# Altium project BF-5-0-0.PrjPCB
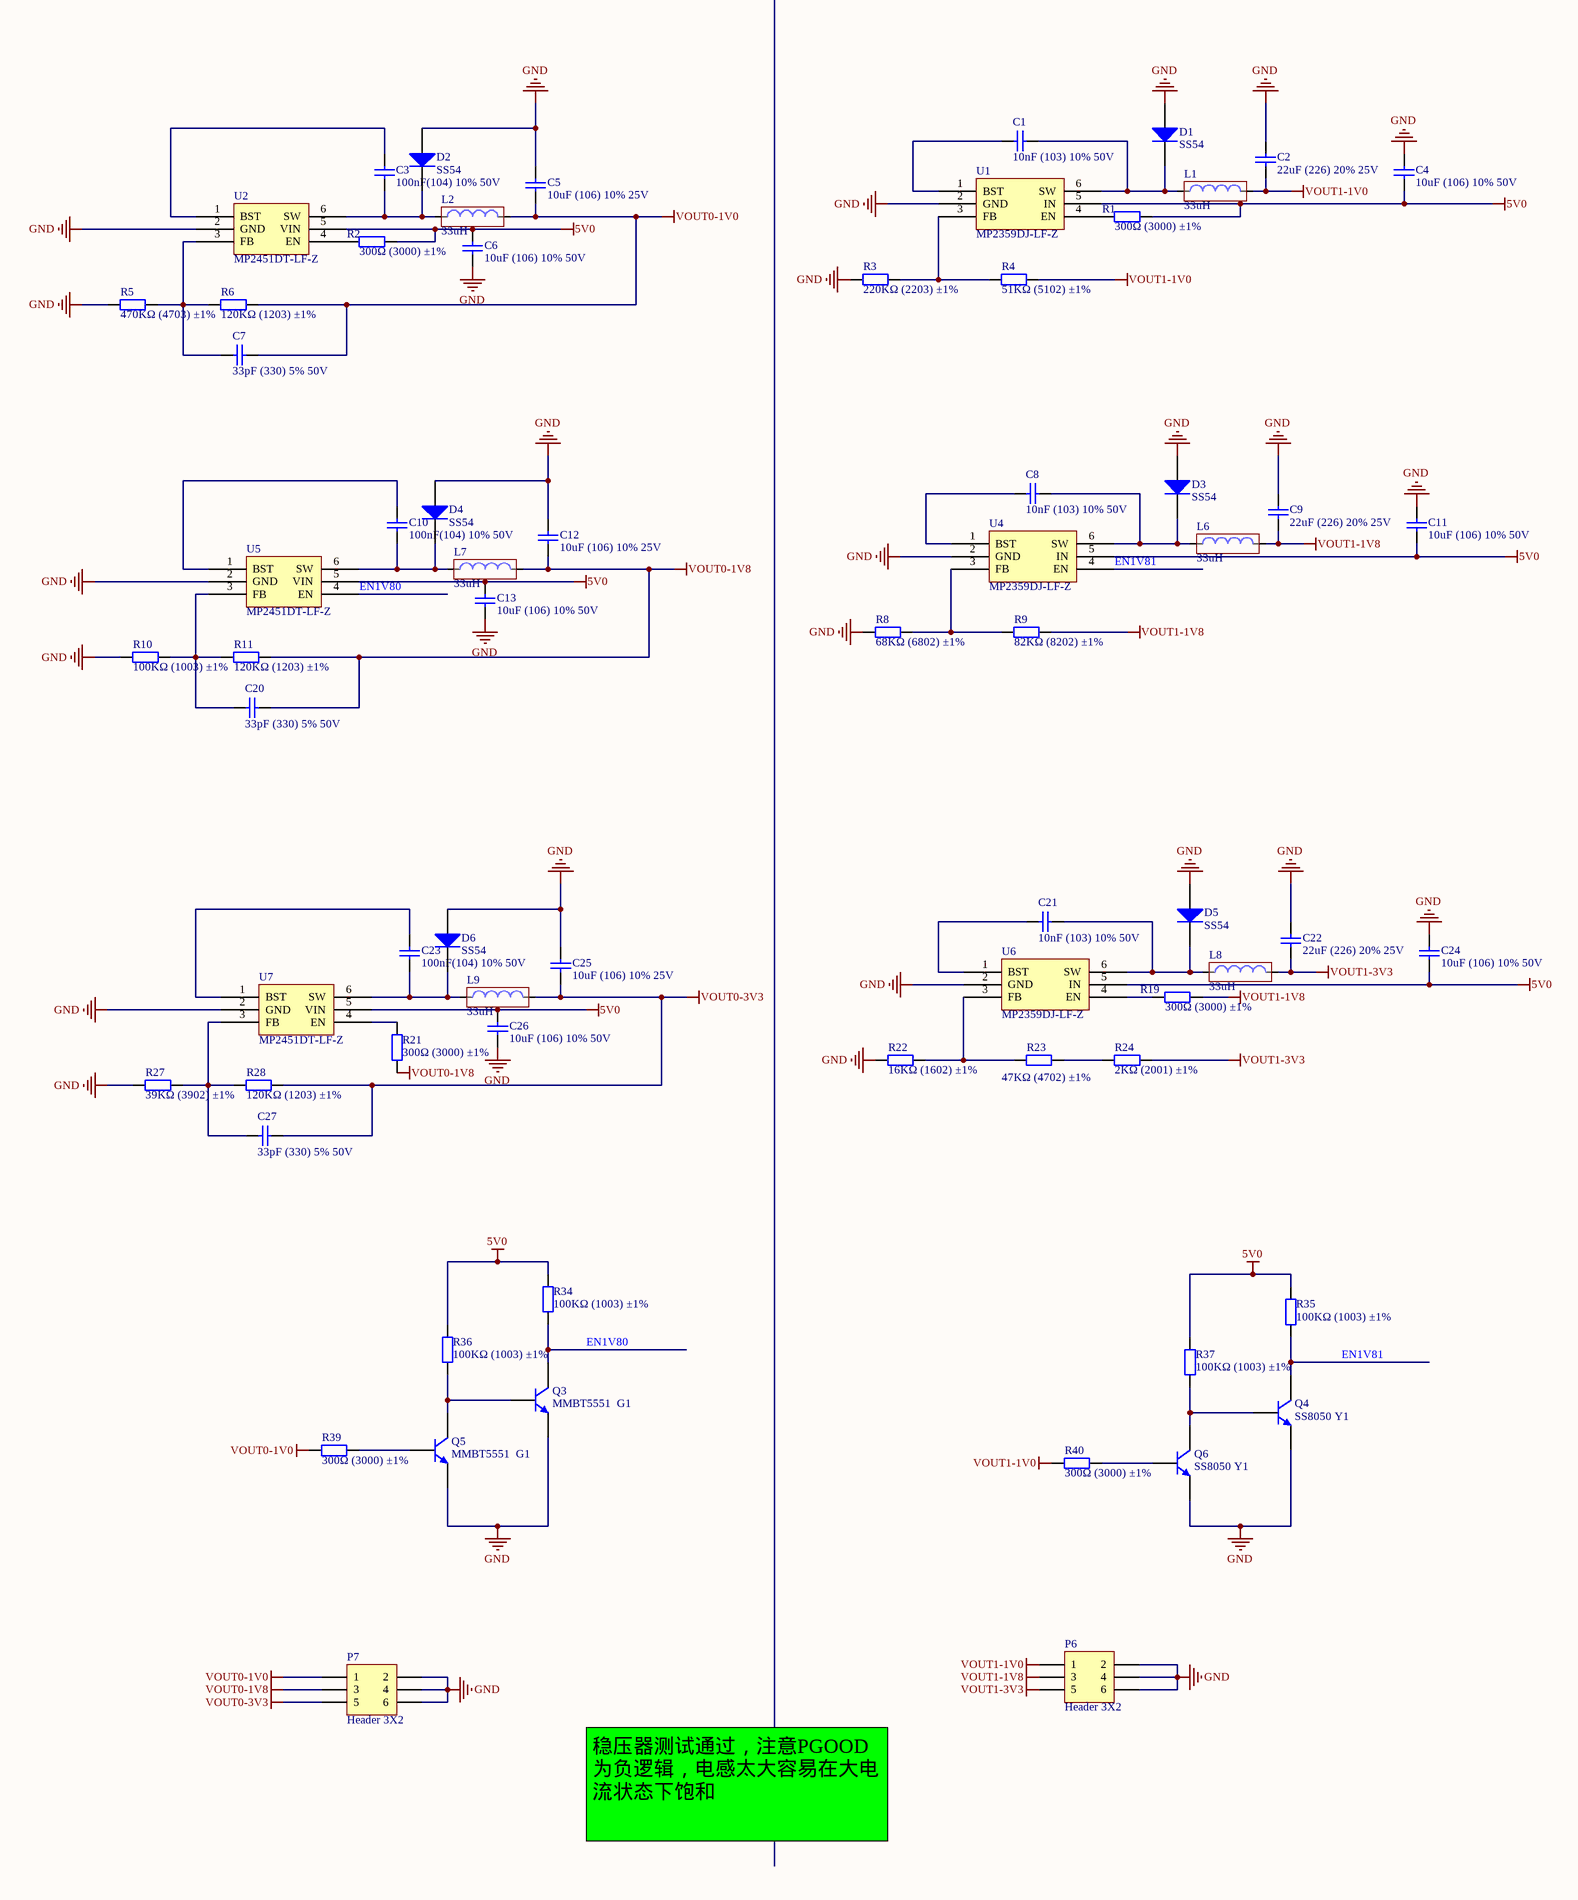
[diagram p0: BF-5-0-0.SchDoc, left]
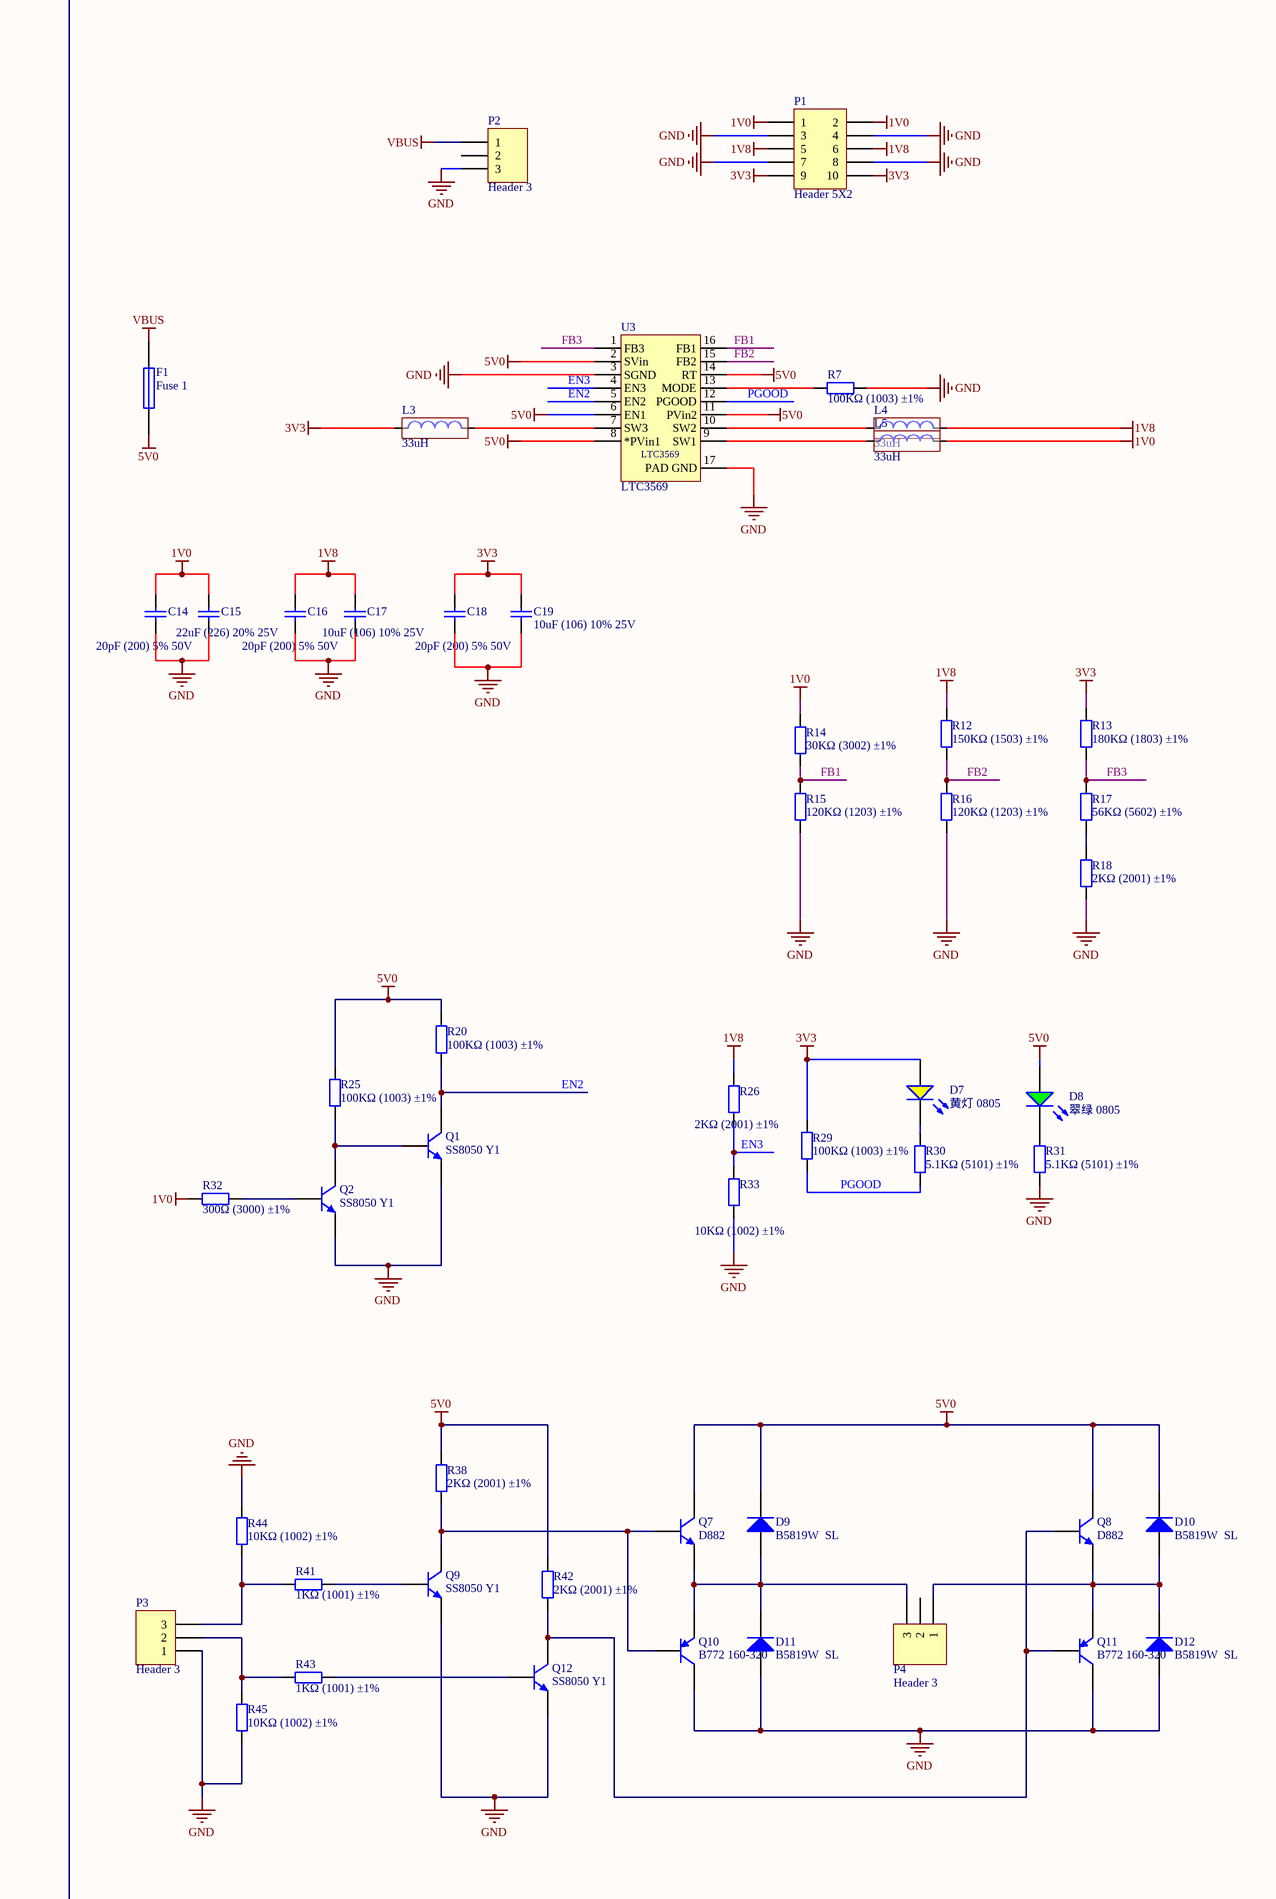
[diagram p1: BF-5-0-0.SchDoc, right]
1 sheet, 119 parts. Net scope: global (net labels, ports and power ports of the same name join across sheets).
Board file: BF-5-0-0.PcbDoc

## Sheet BF-5-0-0.SchDoc
size A2

### Parts
C1  10nF (103) 10% 50V  [0805_C]
C2  22uF (226) 20% 25V  [0805_C]
C3  100nF(104) 10% 50V  [0805_C]
C4  10uF (106) 10% 50V  [1206_C]
C5  10uF (106) 10% 25V  [0805_C]
C6  10uF (106) 10% 50V  [1206_C]
C7  33pF (330) 5% 50V  [0805_C]
C8  10nF (103) 10% 50V  [0805_C]
C9  22uF (226) 20% 25V  [0805_C]
C10  100nF(104) 10% 50V  [0805_C]
C11  10uF (106) 10% 50V  [1206_C]
C12  10uF (106) 10% 25V  [0805_C]
C13  10uF (106) 10% 50V  [1206_C]
C14  20pF (200) 5% 50V  [0805_C]
C15  22uF (226) 20% 25V  [0805_C]
C16  20pF (200) 5% 50V  [0805_C]
C17  10uF (106) 10% 25V  [0805_C]
C18  20pF (200) 5% 50V  [0805_C]
C19  10uF (106) 10% 25V  [0805_C]
C20  33pF (330) 5% 50V  [0805_C]
C21  10nF (103) 10% 50V  [0805_C]
C22  22uF (226) 20% 25V  [0805_C]
C23  100nF(104) 10% 50V  [0805_C]
C24  10uF (106) 10% 50V  [1206_C]
C25  10uF (106) 10% 25V  [0805_C]
C26  10uF (106) 10% 50V  [1206_C]
C27  33pF (330) 5% 50V  [0805_C]
D1  SS54  [SMA(DO-214AC)_S1]
D2  SS54  [SMA(DO-214AC)_S1]
D3  SS54  [SMA(DO-214AC)_S1]
D4  SS54  [SMA(DO-214AC)_S1]
D5  SS54  [SMA(DO-214AC)_S1]
D6  SS54  [SMA(DO-214AC)_S1]
D7  黄灯 0805  [0805_LED_S1]
D8  翠绿 0805  [0805_LED_S1]
D9  B5819W  SL  [SOD-123]
D10  B5819W  SL  [SOD-123]
D11  B5819W  SL  [SOD-123]
D12  B5819W  SL  [SOD-123]
F1  Fuse 1  [1206]
L1  33uH  [L-SMD-7]
L2  33uH  [L-SMD-7]
L3  33uH  [L-SMD-7]
L4  33uH  [L-SMD-7]
L5  33uH  [L-SMD-7]
L6  33uH  [L-SMD-7]
L7  33uH  [L-SMD-7]
L8  33uH  [L-SMD-7]
L9  33uH  [L-SMD-7]
P1  Header 5X2  [HDR2X5]
P2  Header 3  [HDR1X3]
P3  Header 3  [HDR1X3]
P4  Header 3  [HDR1X3]
P6  Header 3X2  [HDR2X3]
P7  Header 3X2  [HDR2X3]
Q1  SS8050 Y1  [SOT-23(SOT-23-3)]
Q2  SS8050 Y1  [SOT-23(SOT-23-3)]
Q3  MMBT5551  G1  [SOT-23(SOT-23-3)]
Q4  SS8050 Y1  [SOT-23(SOT-23-3)]
Q5  MMBT5551  G1  [SOT-23(SOT-23-3)]
Q6  SS8050 Y1  [SOT-23(SOT-23-3)]
Q7  D882  [SOT-89(SOT-89-3)]
Q8  D882  [SOT-89(SOT-89-3)]
Q9  SS8050 Y1  [SOT-23(SOT-23-3)]
Q10  B772 160-320  [SOT-89(SOT-89-3)]
Q11  B772 160-320  [SOT-89(SOT-89-3)]
Q12  SS8050 Y1  [SOT-23(SOT-23-3)]
R1  300Ω (3000) ±1%  [0805_R]
R2  300Ω (3000) ±1%  [0805_R]
R3  220KΩ (2203) ±1%  [0805_R]
R4  51KΩ (5102) ±1%  [0805_R]
R5  470KΩ (4703) ±1%  [0805_R]
R6  120KΩ (1203) ±1%  [0805_R]
R7  100KΩ (1003) ±1%  [0805_R]
R8  68KΩ (6802) ±1%  [0805_R]
R9  82KΩ (8202) ±1%  [0805_R]
R10  100KΩ (1003) ±1%  [0805_R]
R11  120KΩ (1203) ±1%  [0805_R]
R12  150KΩ (1503) ±1%  [0805_R]
R13  180KΩ (1803) ±1%  [0805_R]
R14  30KΩ (3002) ±1%  [0603_R]
R15  120KΩ (1203) ±1%  [0805_R]
R16  120KΩ (1203) ±1%  [0805_R]
R17  56KΩ (5602) ±1%  [0805_R]
R18  2KΩ (2001) ±1%  [0805_R]
R19  300Ω (3000) ±1%  [0805_R]
R20  100KΩ (1003) ±1%  [0805_R]
R21  300Ω (3000) ±1%  [0805_R]
R22  16KΩ (1602) ±1%  [0805_R]
R23  47KΩ (4702) ±1%  [0805_R]
R24  2KΩ (2001) ±1%  [0805_R]
R25  100KΩ (1003) ±1%  [0805_R]
R26  2KΩ (2001) ±1%  [0805_R]
R27  39KΩ (3902) ±1%  [0805_R]
R28  120KΩ (1203) ±1%  [0805_R]
R29  100KΩ (1003) ±1%  [0805_R]
R30  5.1KΩ (5101) ±1%  [0805_R]
R31  5.1KΩ (5101) ±1%  [0805_R]
R32  300Ω (3000) ±1%  [0805_R]
R33  10KΩ (1002) ±1%  [0805_R]
R34  100KΩ (1003) ±1%  [0805_R]
R35  100KΩ (1003) ±1%  [0805_R]
R36  100KΩ (1003) ±1%  [0805_R]
R37  100KΩ (1003) ±1%  [0805_R]
R38  2KΩ (2001) ±1%  [0805_R]
R39  300Ω (3000) ±1%  [0805_R]
R40  300Ω (3000) ±1%  [0805_R]
R41  1KΩ (1001) ±1%  [0805_R]
R42  2KΩ (2001) ±1%  [0805_R]
R43  1KΩ (1001) ±1%  [0805_R]
R44  10KΩ (1002) ±1%  [0805_R]
R45  10KΩ (1002) ±1%  [0805_R]
U1  MP2359DJ-LF-Z  [SOT-23-6]
U2  MP2451DT-LF-Z  [SOT-23-6]
U3  LTC3569  [SOP127P600-16N]
U4  MP2359DJ-LF-Z  [SOT-23-6]
U5  MP2451DT-LF-Z  [SOT-23-6]
U6  MP2359DJ-LF-Z  [SOT-23-6]
U7  MP2451DT-LF-Z  [SOT-23-6]

### Nets
1V0: C14.2 C15.2 L5.2 P1.1 P1.2 R14.2 R32.2
1V8: C16.2 C17.2 L4.2 P1.5 P1.6 R12.2 R26.2
3V3: C18.2 C19.2 D7.A L3.1 P1.9 P1.10 R13.2 R29.2
5V0: C4.2 C6.2 C11.2 C13.2 C24.2 C26.2 D8.A D9.2(K) D10.2(K) F1.1 Q7.2(C) Q8.2(C) R1.2 R2.2 R20.2 R25.2 R34.2 R35.2 R36.2 R37.2 R38.2 R42.2 U1.5(IN) U2.5(VIN) U3.2(SVin) U3.6(EN1) U3.8(*PVin1) U3.11(PVin2) U3.14(RT) U4.5(IN) U5.5(VIN) U6.5(IN) U7.5(VIN)
GND: C2.2 C4.1 C5.2 C6.1 C9.2 C11.1 C12.2 C13.1 C14.1 C15.1 C16.1 C17.1 C18.1 C19.1 C22.2 C24.1 C25.2 C26.1 D1.1(A) D2.1(A) D3.1(A) D4.1(A) D5.1(A) D6.1(A) D11.1(A) D12.1(A) P1.3 P1.4 P1.7 P1.8 P2.3 P3.1 P6.2 P6.4 P6.6 P7.2 P7.4 P7.6 Q1.2(E) Q2.2(E) Q3.2(E) Q4.2(E) Q5.2(E) Q6.2(E) Q9.2(E) Q10.2(C) Q11.2(C) Q12.2(E) R3.2 R5.1 R7.2 R8.1 R10.1 R15.1 R16.1 R18.1 R22.1 R27.1 R31.1 R33.1 R44.2 R45.1 U1.2(GND) U2.2(GND) U3.3(SGND) U3.17(PAD_GND) U4.2(GND) U5.2(GND) U6.2(GND) U7.2(GND)
VBUS: F1.2 P2.1
VOUT0-1V0: C5.1 C7.2 L2.2 P7.1 R6.2 R39.1
VOUT0-1V8: C12.1 C20.2 L7.2 P7.3 R11.2 R21.1
VOUT0-3V3: C25.1 C27.2 L9.2 P7.5 R28.2
VOUT1-1V0: C2.1 L1.2 P6.1 R4.2 R40.2
VOUT1-1V8: C9.1 L6.2 P6.3 R9.2 R19.1
VOUT1-3V3: C22.1 L8.2 P6.5 R24.2
EN1V80: Q3.3(C) R34.1 U5.4(EN)
EN1V81: Q4.3(C) R35.1 U4.4(EN)
EN2: Q1.3(C) R20.1 U3.5(EN2)
EN3: R26.1 R33.2 U3.4(EN3)
FB1: R14.1 R15.2 U3.16(FB1)
FB2: R12.1 R16.2 U3.15(FB2)
FB3: R13.1 R17.2 U3.1(FB3)
PGOOD: R29.1 R30.1 U3.12(PGOOD)
NetC1_1: C1.1 D1.2(K) L1.1 U1.6(SW)
NetC1_2: C1.2 U1.1(BST)
NetC3_1: C3.1 D2.2(K) L2.1 U2.6(SW)
NetC3_2: C3.2 U2.1(BST)
NetC7_1: C7.1 R5.2 R6.1 U2.3(FB)
NetC8_1: C8.1 D3.2(K) L6.1 U4.6(SW)
NetC8_2: C8.2 U4.1(BST)
NetC10_1: C10.1 D4.2(K) L7.1 U5.6(SW)
NetC10_2: C10.2 U5.1(BST)
NetC20_1: C20.1 R10.2 R11.1 U5.3(FB)
NetC21_1: C21.1 D5.2(K) L8.1 U6.6(SW)
NetC21_2: C21.2 U6.1(BST)
NetC23_1: C23.1 D6.2(K) L9.1 U7.6(SW)
NetC23_2: C23.2 U7.1(BST)
NetC27_1: C27.1 R27.2 R28.1 U7.3(FB)
NetD7_K: D7.K R30.2
NetD8_K: D8.K R31.2
NetD9_1: D9.1(A) D11.2(K) P4.3 Q7.3(E) Q10.3(E)
NetD10_1: D10.1(A) D12.2(K) P4.1 Q8.3(E) Q11.3(E)
NetL3_2: L3.2 U3.7(SW3)
NetL4_1: L4.1 U3.10(SW2)
NetL5_1: L5.1 U3.9(SW1)
NetP3_2: P3.2 R43.1 R45.2
NetP3_3: P3.3 R41.1 R44.1
NetQ1_1: Q1.1(B) Q2.3(C) R25.1
NetQ2_1: Q2.1(B) R32.1
NetQ3_1: Q3.1(B) Q5.3(C) R36.1
NetQ4_1: Q4.1(B) Q6.3(C) R37.1
NetQ5_1: Q5.1(B) R39.2
NetQ6_1: Q6.1(B) R40.1
NetQ7_1: Q7.1(B) Q9.3(C) Q10.1(B) R38.1
NetQ8_1: Q8.1(B) Q11.1(B) Q12.3(C) R42.1
NetQ9_1: Q9.1(B) R41.2
NetQ12_1: Q12.1(B) R43.2
NetR1_1: R1.1 U1.4(EN)
NetR2_1: R2.1 U2.4(EN)
NetR3_1: R3.1 R4.1 U1.3(FB)
NetR7_1: R7.1 U3.13(MODE)
NetR8_2: R8.2 R9.1 U4.3(FB)
NetR17_1: R17.1 R18.2
NetR19_2: R19.2 U6.4(EN)
NetR21_2: R21.2 U7.4(EN)
NetR22_2: R22.2 R23.1 U6.3(FB)
NetR23_2: R23.2 R24.1

Not connected (* = marked no-connect by the designer): P2 2; P4 2

### Notes on the sheet
- 稳压器测试通过，注意PGOOD为负逻辑，电感太大容易在大电流状态下饱和

### Library data of the parts
C1 C8 C21 = 0805 10nF (103) 10% 50V: 贴片电容; ComponentLink1Description: 供应商链接; ComponentLink1URL: http://www.szlcsc.com/product/details_2062.html; Package: 0805; Supplier: LC; SuppliersPartNumber: C1710
C2 C9 C15 C22 = 0805 22uF (226) 20% 25V: 贴片电容; ComponentLink1Description: 供应商链接; ComponentLink1URL: http://www.szlcsc.com/product/details_46786.html; Package: 0805; Supplier: LC; SuppliersPartNumber: C45783
C3 C10 C23 = 0805 100nF(104) 10% 50V: 贴片电容; ComponentLink1Description: 供应商链接; ComponentLink1URL: http://www.szlcsc.com/product/details_50686.html; Package: 0805; Supplier: LC; SuppliersPartNumber: C49678
C4 C6 C11 C13 C24 C26 = 1206 10uF (106) 10% 50V: 贴片电容; ComponentLink1Description: 供应商链接; ComponentLink1URL: http://www.szlcsc.com/product/details_14236.html; Package: 1206; Supplier: LC; SuppliersPartNumber: C13585
C5 C12 C17 C19 C25 = 0805 10uF (106) 10% 25V: 贴片电容; ComponentLink1Description: 供应商链接; ComponentLink1URL: http://www.szlcsc.com/product/details_16532.html; Package: 0805; Supplier: LC; SuppliersPartNumber: C15850
C7 C20 C27 = 0805 33pF (330) 5% 50V: 贴片电容; ComponentLink1Description: 供应商链接; ComponentLink1URL: http://www.szlcsc.com/product/details_2166.html; Package: 0805; Supplier: LC; SuppliersPartNumber: C1814
C14 C16 C18 = 0805 20pF (200) 5% 50V: 贴片电容; ComponentLink1Description: 供应商链接; ComponentLink1URL: http://www.szlcsc.com/product/details_2150.html; Package: 0805; Supplier: LC; SuppliersPartNumber: C1798
D1-D6 = SMA(DO-214AC) SS54: 二极管; ComponentLink1Description: 供应商链接; ComponentLink1URL: http://www.szlcsc.com/product/details_23178.html; Package: SMA(DO-214AC); Supplier: LC; SuppliersPartNumber: C22452
D7 = 0805 黄灯: 发光二极管; ComponentLink1Description: 供应商链接; ComponentLink1URL: http://www.szlcsc.com/product/details_2669.html; Package: 0805; Supplier: LC; SuppliersPartNumber: C2296
D8 = 0805 翠绿: 发光二极管; ComponentLink1Description: 供应商链接; ComponentLink1URL: http://www.szlcsc.com/product/details_2670.html; Package: 0805; Supplier: LC; SuppliersPartNumber: C2297
D9-D12 = SOD-123 B5819W  SL: 肖特基二极管; ComponentLink1Description: 供应商链接; ComponentLink1URL: http://www.szlcsc.com/product/details_9093.html; Package: SOD-123; Supplier: LC; SuppliersPartNumber: C8598
F1 = Fuse 1: Fuse; Published: 8-Jun-2000; LatestRevisionDate: 17-Jul-2002; LatestRevisionNote: Re-released for DXP Platform.; PackageReference: PIN-W2/E2.8; Publisher: Altium Limited; PackageDescription: Thru-Hole; 2 Leads
L1-L9 = Inductor_1: Inductor
P1 = Header 5X2: Header, 5-Pin, Dual row; LatestRevisionDate: 17-Jul-2002; LatestRevisionNote: Re-released for DXP Platform.; Publisher: Altium Limited
P2-P4 = Header 3: Header, 3-Pin; LatestRevisionDate: 17-Jul-2002; LatestRevisionNote: Re-released for DXP Platform.; Publisher: Altium Limited
P6 P7 = Header 3X2: Header, 3-Pin, Dual row; LatestRevisionDate: 17-Jul-2002; LatestRevisionNote: Re-released for DXP Platform.; Publisher: Altium Limited
Q1 Q2 Q4 Q6 Q9 Q12 = SOT-23 SS8050 Y1: 三极管; ComponentLink1Description: 供应商链接; ComponentLink1URL: http://www.szlcsc.com/product/details_2507.html; Package: SOT-23; Supplier: LC; SuppliersPartNumber: C2150
Q3 Q5 = SOT-23 MMBT5551  G1: 三极管; ComponentLink1Description: 供应商链接; ComponentLink1URL: http://www.szlcsc.com/product/details_2502.html; Package: SOT-23; Supplier: LC; SuppliersPartNumber: C2145
Q7 Q8 = SOT-89 D882: 三极管; ComponentLink1Description: 供应商链接; ComponentLink1URL: http://www.szlcsc.com/product/details_10164.html; Package: SOT-89; Supplier: LC; SuppliersPartNumber: C9634
Q10 Q11 = SOT-89 B772 160-320: 三极管; ComponentLink1Description: 供应商链接; ComponentLink1URL: http://www.szlcsc.com/product/details_25018.html; Package: SOT-89; Supplier: LC; SuppliersPartNumber: C24278
R1 R2 R19 R21 R32 R39 R40 = 0805 300Ω (3000) 1%: 贴片电阻; ComponentLink1Description: 供应商链接; ComponentLink1URL: http://www.szlcsc.com/product/details_18305.html; Package: 0805; Supplier: LC; SuppliersPartNumber: C17617
R3 = 0805 220KΩ (2203) 1%: 贴片电阻; ComponentLink1Description: 供应商链接; ComponentLink1URL: http://www.szlcsc.com/product/details_18244.html; Package: 0805; Supplier: LC; SuppliersPartNumber: C17556
R4 = 0805 51KΩ (5102) 1%: 贴片电阻; ComponentLink1Description: 供应商链接; ComponentLink1URL: http://www.szlcsc.com/product/details_18425.html; Package: 0805; Supplier: LC; SuppliersPartNumber: C17737
R5 = 0805 470KΩ (4703) 1%: 贴片电阻; ComponentLink1Description: 供应商链接; ComponentLink1URL: http://www.szlcsc.com/product/details_18397.html; Package: 0805; Supplier: LC; SuppliersPartNumber: C17709
R6 R11 R15 R16 R28 = 0805 120KΩ (1203) 1%: 贴片电阻; ComponentLink1Description: 供应商链接; ComponentLink1URL: http://www.szlcsc.com/product/details_18124.html; Package: 0805; Supplier: LC; SuppliersPartNumber: C17436
R7 R10 R20 R25 R29 R34-R37 = 0805 100KΩ (1003) 1%: 贴片电阻; ComponentLink1Description: 供应商链接; ComponentLink1URL: http://www.szlcsc.com/product/details_18095.html; Package: 0805; Supplier: LC; SuppliersPartNumber: C17407
R8 = 0805 68KΩ (6802) 1%: 贴片电阻; ComponentLink1Description: 供应商链接; ComponentLink1URL: http://www.szlcsc.com/product/details_18489.html; Package: 0805; Supplier: LC; SuppliersPartNumber: C17801
R9 = 0805 82KΩ (8202) 1%: 贴片电阻; ComponentLink1Description: 供应商链接; ComponentLink1URL: http://www.szlcsc.com/product/details_18528.html; Package: 0805; Supplier: LC; SuppliersPartNumber: C17840
R12 = 0805 150KΩ (1503) 1%: 贴片电阻; ComponentLink1Description: 供应商链接; ComponentLink1URL: http://www.szlcsc.com/product/details_18158.html; Package: 0805; Supplier: LC; SuppliersPartNumber: C17470
R13 = 0805 180KΩ (1803) 1%: 贴片电阻; ComponentLink1Description: 供应商链接; ComponentLink1URL: http://www.szlcsc.com/product/details_18189.html; Package: 0805; Supplier: LC; SuppliersPartNumber: C17501
R14 = 0603 30KΩ (3002) 1%: 贴片电阻; ComponentLink1Description: 供应商链接; ComponentLink1URL: http://www.szlcsc.com/product/details_23711.html; Package: 0603; Supplier: LC; SuppliersPartNumber: C22984
R17 = 0805 56KΩ (5602) 1%: 贴片电阻; ComponentLink1Description: 供应商链接; ComponentLink1URL: http://www.szlcsc.com/product/details_18444.html; Package: 0805; Supplier: LC; SuppliersPartNumber: C17756
R18 R24 R26 R38 R42 = 0805 2KΩ (2001) 1%: 贴片电阻; ComponentLink1Description: 供应商链接; ComponentLink1URL: http://www.szlcsc.com/product/details_18292.html; Package: 0805; Supplier: LC; SuppliersPartNumber: C17604
R22 = 0805 16KΩ (1602) 1%: 贴片电阻; ComponentLink1Description: 供应商链接; ComponentLink1URL: http://www.szlcsc.com/product/details_18178.html; Package: 0805; Supplier: LC; SuppliersPartNumber: C17490
R23 = 0805 47KΩ (4702) 1%: 贴片电阻; ComponentLink1Description: 供应商链接; ComponentLink1URL: http://www.szlcsc.com/product/details_18401.html; Package: 0805; Supplier: LC; SuppliersPartNumber: C17713
R27 = 0805 39KΩ (3902) 1%: 贴片电阻; ComponentLink1Description: 供应商链接; ComponentLink1URL: http://www.szlcsc.com/product/details_26569.html; Package: 0805; Supplier: LC; SuppliersPartNumber: C25826
R30 R31 = 0805 5.1KΩ (5101) 1%: 贴片电阻; ComponentLink1Description: 供应商链接; ComponentLink1URL: http://www.szlcsc.com/product/details_28584.html; Package: 0805; Supplier: LC; SuppliersPartNumber: C27834
R33 R44 R45 = 0805 10KΩ (1002) 1%: 贴片电阻; ComponentLink1Description: 供应商链接; ComponentLink1URL: http://www.szlcsc.com/product/details_18102.html; Package: 0805; Supplier: LC; SuppliersPartNumber: C17414
R41 R43 = 0805 1KΩ (1001) 1%: 贴片电阻; ComponentLink1Description: 供应商链接; ComponentLink1URL: http://www.szlcsc.com/product/details_18201.html; Package: 0805; Supplier: LC; SuppliersPartNumber: C17513
U1 U4 U6 = MP2359DJ-LF-Z_[C14259]: DC-DC芯片; ComponentLink1Description: 供应商链接; ComponentLink1URL: http://www.szlcsc.com/product/details_14917.html; Package: SOT-23-6; Supplier: LC; SuppliersPartNumber: C14259
U2 U5 U7 = MP2451DT-LF-Z_[C14123]: DC-DC芯片; ComponentLink1Description: 供应商链接; ComponentLink1URL: http://www.szlcsc.com/product/details_14780.html; Package: SOT-23-6; Supplier: LC; SuppliersPartNumber: C14123